# EAGLE design BattleBits_V2_routed (EAGLE 9.3.2)
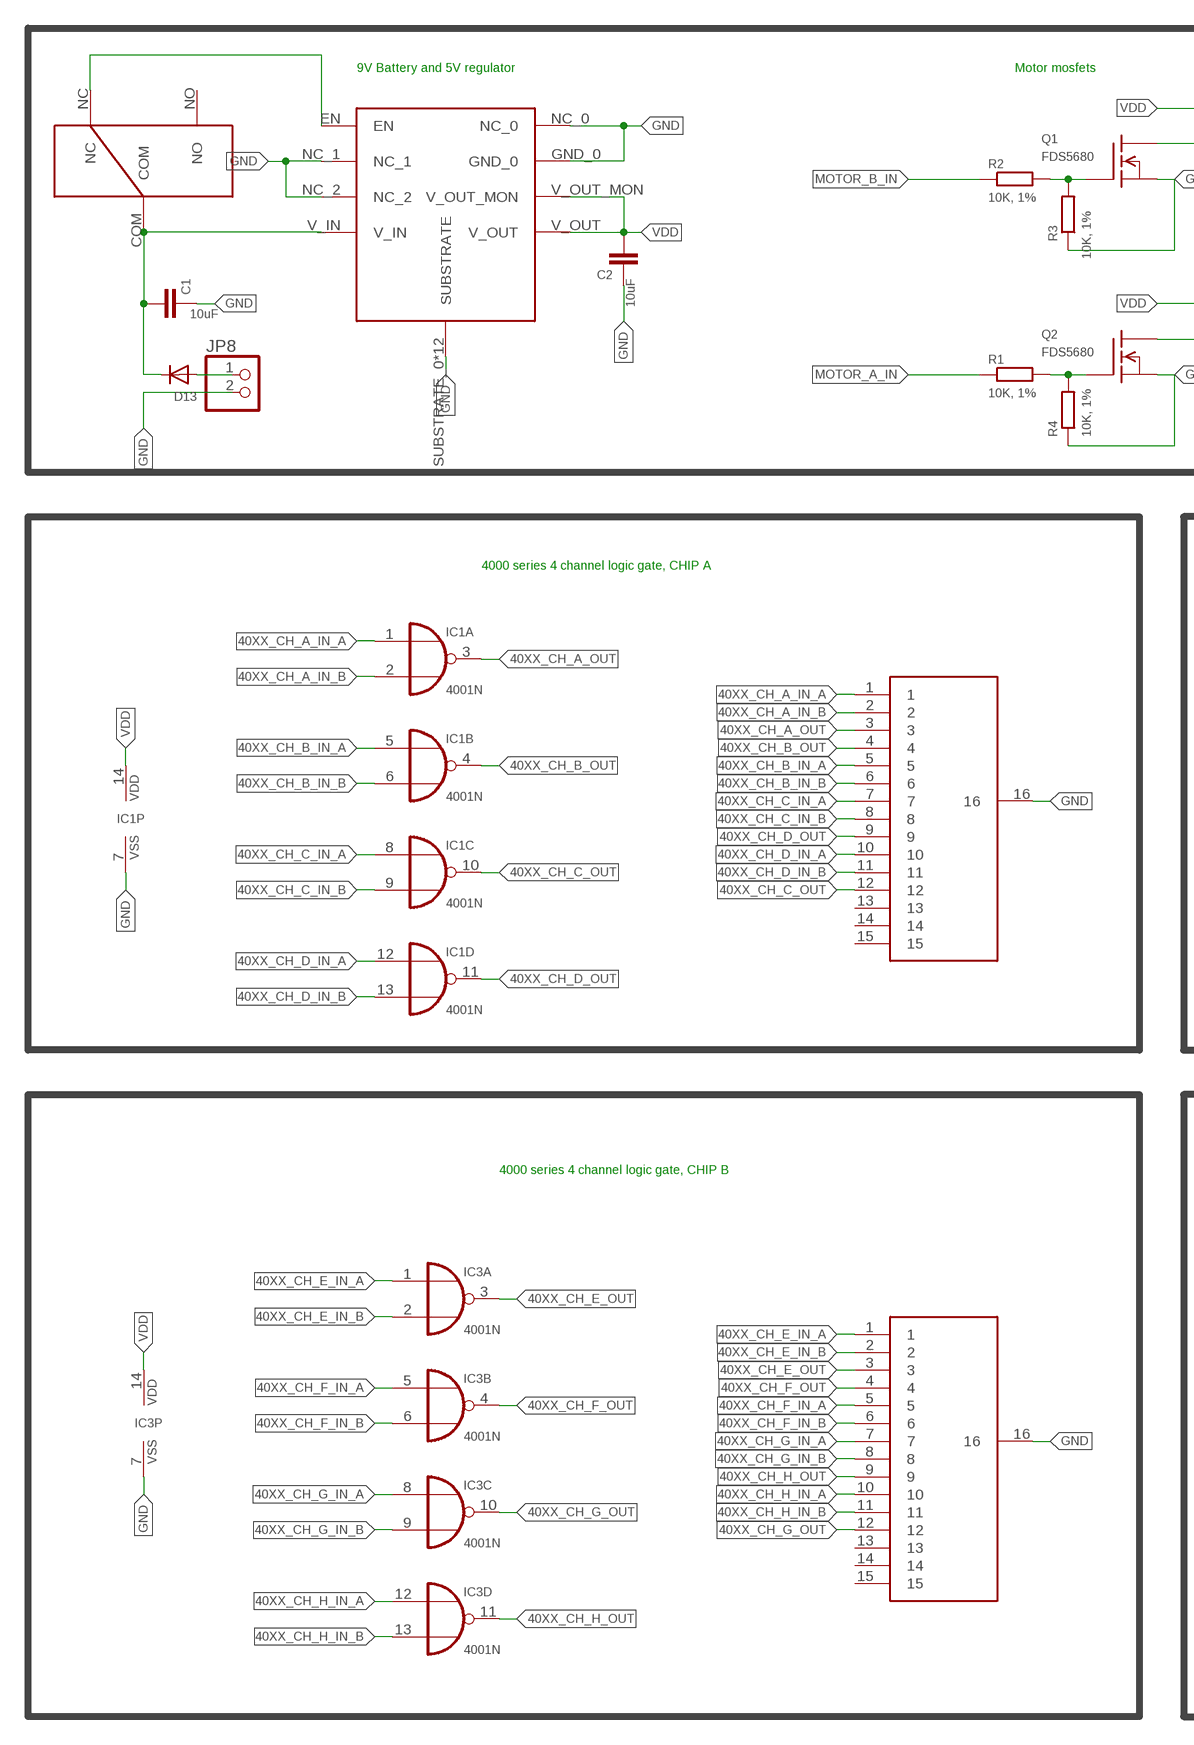
[diagram p0: schematic, sheet 1, part 1 of 2]
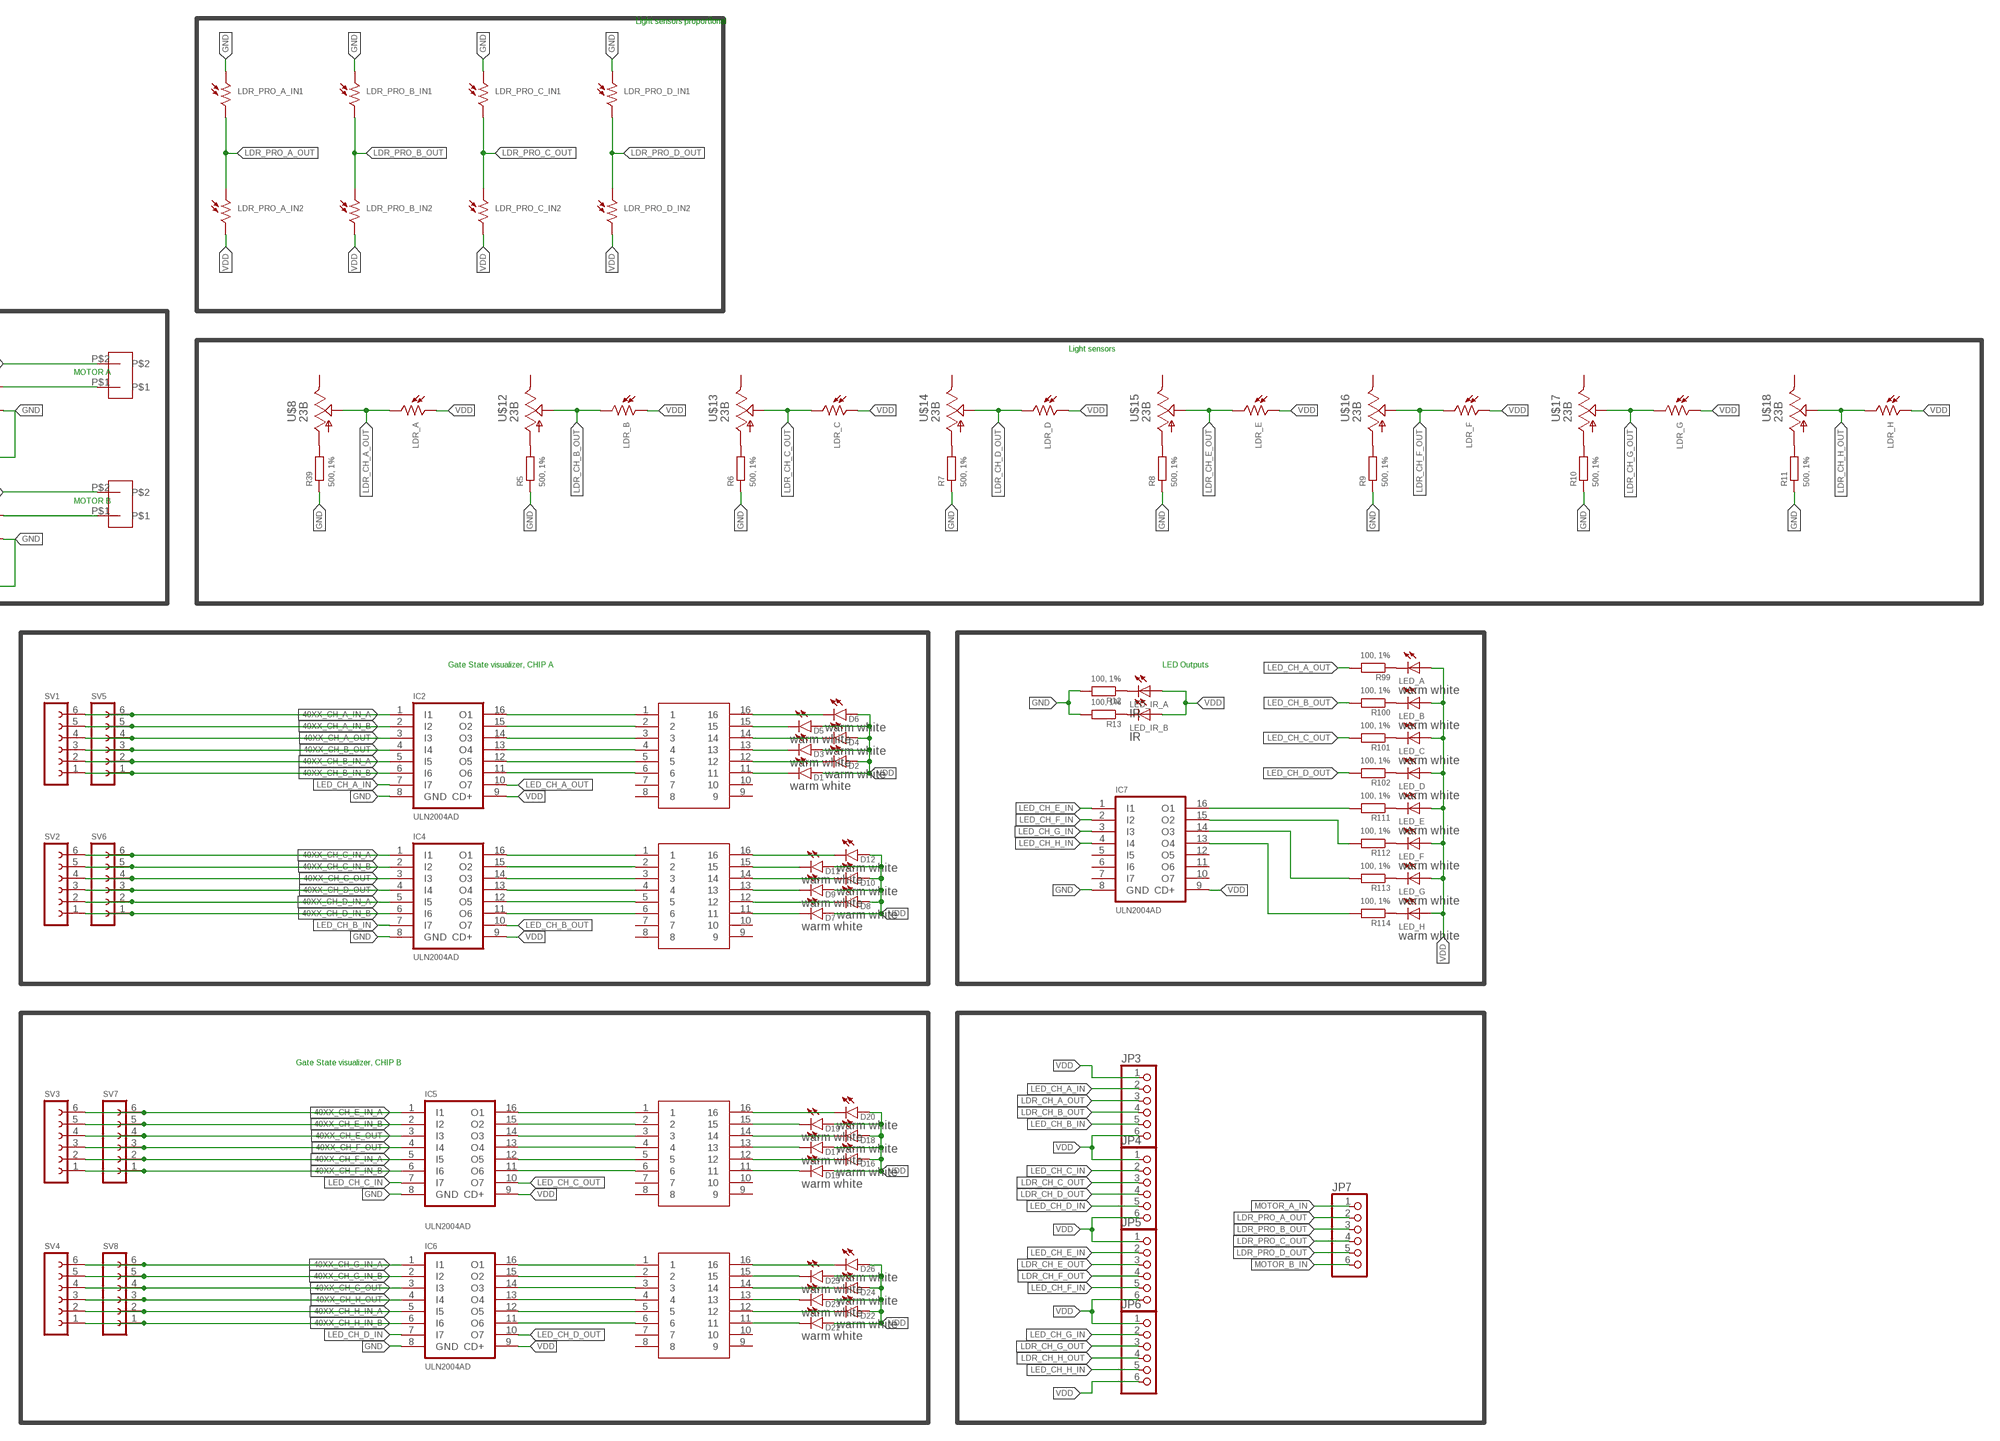
[diagram p1: schematic, sheet 1, part 2 of 2]

## Parts
C1  10uF  C-EUC3216  [C3216]
C2  10uF  C-EUC3216  [C3216]
D1  warm white  LED1206  [LED-1206]
D2  warm white  LED1206  [LED-1206]
D3  warm white  LED1206  [LED-1206]
D4  warm white  LED1206  [LED-1206]
D5  warm white  LED1206  [LED-1206]
D6  warm white  LED1206  [LED-1206]
D7  warm white  LED1206  [LED-1206]
D8  warm white  LED1206  [LED-1206]
D9  warm white  LED1206  [LED-1206]
D10  warm white  LED1206  [LED-1206]
D11  warm white  LED1206  [LED-1206]
D12  warm white  LED1206  [LED-1206]
D13  DIODESMA  [SMADIODE]
D15  warm white  LED1206  [LED-1206]
D16  warm white  LED1206  [LED-1206]
D17  warm white  LED1206  [LED-1206]
D18  warm white  LED1206  [LED-1206]
D19  warm white  LED1206  [LED-1206]
D20  warm white  LED1206  [LED-1206]
D21  warm white  LED1206  [LED-1206]
D22  warm white  LED1206  [LED-1206]
D23  warm white  LED1206  [LED-1206]
D24  warm white  LED1206  [LED-1206]
D25  warm white  LED1206  [LED-1206]
D26  warm white  LED1206  [LED-1206]
IC1  4001N  [DIL14]
IC2  ULN2004AD  [SO16]
IC3  4001N  [DIL14]
IC4  ULN2004AD  [SO16]
IC5  ULN2004AD  [SO16]
IC6  ULN2004AD  [SO16]
IC7  ULN2004AD  [SO16]
JP3  PINHD-1X6  [1X06]
JP4  PINHD-1X6  [1X06]
JP5  PINHD-1X6  [1X06]
JP6  PINHD-1X6  [1X06]
JP7  PINHD-1X6  [1X06]
JP8  PINHD-1X2  [1X02]
LDR_A  V1060_21  [TO-5_V10]
LDR_B  V1060_21  [TO-5_V10]
LDR_C  V1060_21  [TO-5_V10]
LDR_D  V1060_21  [TO-5_V10]
LDR_E  V1060_21  [TO-5_V10]
LDR_F  V1060_21  [TO-5_V10]
LDR_G  V1060_21  [TO-5_V10]
LDR_H  V1060_21  [TO-5_V10]
LDR_PRO_A_IN1  V1060_21  [TO-5_V10]
LDR_PRO_A_IN2  V1060_21  [TO-5_V10]
LDR_PRO_B_IN1  V1060_21  [TO-5_V10]
LDR_PRO_B_IN2  V1060_21  [TO-5_V10]
LDR_PRO_C_IN1  V1060_21  [TO-5_V10]
LDR_PRO_C_IN2  V1060_21  [TO-5_V10]
LDR_PRO_D_IN1  V1060_21  [TO-5_V10]
LDR_PRO_D_IN2  V1060_21  [TO-5_V10]
LED_A  warm white  LED5MM  [LED5MM]
LED_B  warm white  LED5MM  [LED5MM]
LED_C  warm white  LED5MM  [LED5MM]
LED_D  warm white  LED5MM  [LED5MM]
LED_E  warm white  LED5MM  [LED5MM]
LED_F  warm white  LED5MM  [LED5MM]
LED_G  warm white  LED5MM  [LED5MM]
LED_H  warm white  LED5MM  [LED5MM]
LED_IR_A  IR  LED5MM  [LED5MM]
LED_IR_B  IR  LED5MM  [LED5MM]
Q1  FDS5680  [SO-8]
Q2  FDS5680  [SO-8]
R1  10K, 1%  R-EU_R3216  [R3216]
R2  10K, 1%  R-EU_R3216  [R3216]
R3  10K, 1%  R-EU_R3216  [R3216]
R4  10K, 1%  R-EU_R3216  [R3216]
R5  500, 1%  R-EU_R3216  [R3216]
R6  500, 1%  R-EU_R3216  [R3216]
R7  500, 1%  R-EU_R3216  [R3216]
R8  500, 1%  R-EU_R3216  [R3216]
R9  500, 1%  R-EU_R3216  [R3216]
R10  500, 1%  R-EU_R3216  [R3216]
R11  500, 1%  R-EU_R3216  [R3216]
R12  100, 1%  R-EU_R3216  [R3216]
R13  100, 1%  R-EU_R3216  [R3216]
R39  500, 1%  R-EU_R3216  [R3216]
R99  100, 1%  R-EU_R3216  [R3216]
R100  100, 1%  R-EU_R3216  [R3216]
R101  100, 1%  R-EU_R3216  [R3216]
R102  100, 1%  R-EU_R3216  [R3216]
R111  100, 1%  R-EU_R3216  [R3216]
R112  100, 1%  R-EU_R3216  [R3216]
R113  100, 1%  R-EU_R3216  [R3216]
R114  100, 1%  R-EU_R3216  [R3216]
SV1  FE06-1  [FE06]
SV2  FE06-1  [FE06]
SV3  FE06-1  [FE06]
SV4  FE06-1  [FE06]
SV5  FE06-1  [FE06]
SV6  FE06-1  [FE06]
SV7  FE06-1  [FE06]
SV8  FE06-1  [FE06]
U$1  MOTOR  [GEARMOTOR]
U$2  MOTOR  [GEARMOTOR]
U$3  15_RES_BUS_SOIC16  [SO16]
U$4  ROHM_LDO  [HTSOP-J8]
U$5  8_RES_ISO_SOIC-16  [SO16]
U$6  8_RES_ISO_SOIC-16  [SO16]
U$7  SLIDE_SWITCH  [SLIDE_SWITCH]
U$8  23B  [23B-GULL_WING]
U$9  8_RES_ISO_SOIC-16  [SO16]
U$10  8_RES_ISO_SOIC-16  [SO16]
U$11  15_RES_BUS_SOIC16  [SO16]
U$12  23B  [23B-GULL_WING]
U$13  23B  [23B-GULL_WING]
U$14  23B  [23B-GULL_WING]
U$15  23B  [23B-GULL_WING]
U$16  23B  [23B-GULL_WING]
U$17  23B  [23B-GULL_WING]
U$18  23B  [23B-GULL_WING]

## Nets
40XX_CH_A_IN_A [SIGNAL]: IC1.1(A:I0) IC2.1(I1) SV1.6 SV5.6 U$11.1
40XX_CH_A_IN_B [SIGNAL]: IC1.2(A:I1) IC2.2(I2) SV1.5 SV5.5 U$11.2
40XX_CH_A_OUT [SIGNAL]: IC1.3(A:O) IC2.3(I3) SV1.4 SV5.4 U$11.3
40XX_CH_B_IN_A [SIGNAL]: IC1.5(B:I0) IC2.5(I5) SV1.2 SV5.2 U$11.5
40XX_CH_B_IN_B [SIGNAL]: IC1.6(B:I1) IC2.6(I6) SV1.1 SV5.1 U$11.6
40XX_CH_B_OUT [SIGNAL]: IC1.4(B:O) IC2.4(I4) SV1.3 SV5.3 U$11.4
40XX_CH_C_IN_A [SIGNAL]: IC1.8(C:I0) IC4.1(I1) SV2.6 SV6.6 U$11.7
40XX_CH_C_IN_B [SIGNAL]: IC1.9(C:I1) IC4.2(I2) SV2.5 SV6.5 U$11.8
40XX_CH_C_OUT [SIGNAL]: IC1.10(C:O) IC4.3(I3) SV2.4 SV6.4 U$11.12
40XX_CH_D_IN_A [SIGNAL]: IC1.12(D:I0) IC4.5(I5) SV2.2 SV6.2 U$11.10
40XX_CH_D_IN_B [SIGNAL]: IC1.13(D:I1) IC4.6(I6) SV2.1 SV6.1 U$11.11
40XX_CH_D_OUT [SIGNAL]: IC1.11(D:O) IC4.4(I4) SV2.3 SV6.3 U$11.9
40XX_CH_E_IN_A [SIGNAL]: IC3.1(A:I0) IC5.1(I1) SV3.6 SV7.6 U$3.1
40XX_CH_E_IN_B [SIGNAL]: IC3.2(A:I1) IC5.2(I2) SV3.5 SV7.5 U$3.2
40XX_CH_E_OUT [SIGNAL]: IC3.3(A:O) IC5.3(I3) SV3.4 SV7.4 U$3.3
40XX_CH_F_IN_A [SIGNAL]: IC3.5(B:I0) IC5.5(I5) SV3.2 SV7.2 U$3.5
40XX_CH_F_IN_B [SIGNAL]: IC3.6(B:I1) IC5.6(I6) SV3.1 SV7.1 U$3.6
40XX_CH_F_OUT [SIGNAL]: IC3.4(B:O) IC5.4(I4) SV3.3 SV7.3 U$3.4
40XX_CH_G_IN_A [SIGNAL]: IC3.8(C:I0) IC6.1(I1) SV4.6 SV8.6 U$3.7
40XX_CH_G_IN_B [SIGNAL]: IC3.9(C:I1) IC6.2(I2) SV4.5 SV8.5 U$3.8
40XX_CH_G_OUT [SIGNAL]: IC3.10(C:O) IC6.3(I3) SV4.4 SV8.4 U$3.12
40XX_CH_H_IN_A [SIGNAL]: IC3.12(D:I0) IC6.5(I5) SV4.2 SV8.2 U$3.10
40XX_CH_H_IN_B [SIGNAL]: IC3.13(D:I1) IC6.6(I6) SV4.1 SV8.1 U$3.11
40XX_CH_H_OUT [SIGNAL]: IC3.11(D:O) IC6.4(I4) SV4.3 SV8.3 U$3.9
GND: C1.1 C2.1 IC1.7(P:VSS) IC2.8(GND) IC3.7(P:VSS) IC4.8(GND) IC5.8(GND) IC6.8(GND) IC7.8(GND) JP8.2 LDR_PRO_A_IN1.1 LDR_PRO_B_IN1.1 LDR_PRO_C_IN1.1 LDR_PRO_D_IN1.1 Q1.1(S) Q1.2(S) Q1.3(S) Q2.1(S) Q2.2(S) Q2.3(S) R3.1 R4.1 R5.1 R6.1 R7.1 R8.1 R9.1 R10.1 R11.1 R12.2 R13.2 R39.1 U$3.16 U$4.GND_0 U$4.NC_0 U$4.NC_1 U$4.NC_2 U$4.SUBSTRATE_0(SUBSTRATE) U$4.SUBSTRATE_1(SUBSTRATE) U$4.SUBSTRATE_2(SUBSTRATE) U$4.SUBSTRATE_3(SUBSTRATE) U$4.SUBSTRATE_4(SUBSTRATE) U$4.SUBSTRATE_5(SUBSTRATE) U$4.SUBSTRATE_6(SUBSTRATE) U$4.SUBSTRATE_7(SUBSTRATE) U$4.SUBSTRATE_8(SUBSTRATE) U$4.SUBSTRATE_9(SUBSTRATE) U$4.SUBSTRATE_10(SUBSTRATE) U$4.SUBSTRATE_11(SUBSTRATE) U$11.16
LDR_CH_A_OUT [SIGNAL]: JP3.3 LDR_A.2 U$8.2
LDR_CH_B_OUT: JP3.4 LDR_B.2 U$12.2
LDR_CH_C_OUT [SIGNAL]: JP4.3 LDR_C.2 U$13.2
LDR_CH_D_OUT: JP4.4 LDR_D.2 U$14.2
LDR_CH_E_OUT [SIGNAL]: JP5.3 LDR_E.2 U$15.2
LDR_CH_F_OUT: JP5.4 LDR_F.2 U$16.2
LDR_CH_G_OUT [SIGNAL]: JP6.3 LDR_G.2 U$17.2
LDR_CH_H_OUT: JP6.4 LDR_H.2 U$18.2
LDR_PRO_A_OUT: JP7.2 LDR_PRO_A_IN1.2 LDR_PRO_A_IN2.1
LDR_PRO_B_OUT: JP7.3 LDR_PRO_B_IN1.2 LDR_PRO_B_IN2.1
LDR_PRO_C_OUT: JP7.4 LDR_PRO_C_IN1.2 LDR_PRO_C_IN2.1
LDR_PRO_D_OUT: JP7.5 LDR_PRO_D_IN1.2 LDR_PRO_D_IN2.1
LED_CH_A_IN [SIGNAL]: IC2.7(I7) JP3.2
LED_CH_A_OUT: IC2.10(O7) R99.2
LED_CH_B_IN [SIGNAL]: IC4.7(I7) JP3.5
LED_CH_B_OUT: IC4.10(O7) R100.2
LED_CH_C_IN [SIGNAL]: IC5.7(I7) JP4.2
LED_CH_C_OUT: IC5.10(O7) R101.2
LED_CH_D_IN [SIGNAL]: IC6.7(I7) JP4.5
LED_CH_D_OUT: IC6.10(O7) R102.2
LED_CH_E_IN [SIGNAL]: IC7.1(I1) JP5.2
LED_CH_F_IN [SIGNAL]: IC7.2(I2) JP5.5
LED_CH_G_IN [SIGNAL]: IC7.3(I3) JP6.2
LED_CH_H_IN [SIGNAL]: IC7.4(I4) JP6.5
MOTOR_A-: Q1.5(D) Q1.6(D) Q1.7(D) Q1.8(D) U$1.P$1
MOTOR_A_IN [SIGNAL]: JP7.1 R1.1
MOTOR_B-: Q2.5(D) Q2.6(D) Q2.7(D) Q2.8(D) U$2.P$1
MOTOR_B_IN [SIGNAL]: JP7.6 R2.1
N$5: IC2.16(O1) U$5.1
N$6 [SIGNAL]: Q1.4(G) R2.2 R3.2
N$7 [SIGNAL]: Q2.4(G) R1.2 R4.2
N$8: IC2.15(O2) U$5.2
N$9: IC2.14(O3) U$5.3
N$10: IC2.13(O4) U$5.4
N$11: IC2.12(O5) U$5.5
N$12: IC2.11(O6) U$5.6
N$13: IC6.16(O1) U$10.1
N$14: IC4.16(O1) U$6.1
N$15: IC4.15(O2) U$6.2
N$16: IC4.14(O3) U$6.3
N$17: IC4.13(O4) U$6.4
N$18: IC4.12(O5) U$6.5
N$19: IC4.11(O6) U$6.6
N$20: D6.C U$5.16
N$21: IC6.14(O3) U$10.3
N$22: D5.C U$5.15
N$23: IC5.16(O1) U$9.1
N$24: D4.C U$5.14
N$25: IC5.15(O2) U$9.2
N$26: D3.C U$5.13
N$27: IC5.14(O3) U$9.3
N$28: D2.C U$5.12
N$29: IC5.13(O4) U$9.4
N$30: D1.C U$5.11
N$31: IC5.12(O5) U$9.5
N$32: IC5.11(O6) U$9.6
N$33: IC6.15(O2) U$10.2
N$34: IC6.13(O4) U$10.4
N$35: IC6.12(O5) U$10.5
N$36: D12.C U$6.16
N$37: D11.C U$6.15
N$38: IC6.11(O6) U$10.6
N$39: D10.C U$6.14
N$40: D9.C U$6.13
N$41: D8.C U$6.12
N$42: D7.C U$6.11
N$44 [SIGNAL]: R39.2 U$8.1
N$45 [SIGNAL]: R5.2 U$12.1
N$46: IC7.16(O1) R111.2
N$47: IC7.15(O2) R112.2
N$48: IC7.14(O3) R113.2
N$49: IC7.13(O4) R114.2
N$50 [SIGNAL]: R6.2 U$13.1
N$51 [SIGNAL]: R7.2 U$14.1
N$52 [SIGNAL]: R8.2 U$15.1
N$53 [SIGNAL]: R9.2 U$16.1
N$54 [SIGNAL]: R10.2 U$17.1
N$55 [SIGNAL]: R11.2 U$18.1
N$61: D13.A JP8.1
N$62: U$4.EN U$7.NC
N$63: LED_IR_A.K(C) R12.1
N$64: LED_IR_B.K(C) R13.1
N$86: D20.C U$9.16
N$87: D19.C U$9.15
N$88: D18.C U$9.14
N$89: D17.C U$9.13
N$90: D16.C U$9.12
N$91: D15.C U$9.11
N$92: D26.C U$10.16
N$93: D25.C U$10.15
N$94: D24.C U$10.14
N$95: D23.C U$10.13
N$96: D22.C U$10.12
N$97: D21.C U$10.11
N$111: LED_A.K(C) R99.1
N$112: LED_B.K(C) R100.1
N$113: LED_C.K(C) R101.1
N$114: LED_D.K(C) R102.1
N$123: LED_E.K(C) R111.1
N$124: LED_F.K(C) R112.1
N$125: LED_G.K(C) R113.1
N$126: LED_H.K(C) R114.1
VBAT: C1.2 D13.C U$4.V_IN U$7.COM
VDD: C2.2 D1.A D2.A D3.A D4.A D5.A D6.A D7.A D8.A D9.A D10.A D11.A D12.A D15.A D16.A D17.A D18.A D19.A D20.A D21.A D22.A D23.A D24.A D25.A D26.A IC1.14(P:VDD) IC2.9(CD+) IC3.14(P:VDD) IC4.9(CD+) IC5.9(CD+) IC6.9(CD+) IC7.9(CD+) JP3.1 JP3.6 JP4.1 JP4.6 JP5.1 JP5.6 JP6.1 JP6.6 LDR_A.1 LDR_B.1 LDR_C.1 LDR_D.1 LDR_E.1 LDR_F.1 LDR_G.1 LDR_H.1 LDR_PRO_A_IN2.2 LDR_PRO_B_IN2.2 LDR_PRO_C_IN2.2 LDR_PRO_D_IN2.2 LED_A.A LED_B.A LED_C.A LED_D.A LED_E.A LED_F.A LED_G.A LED_H.A LED_IR_A.A LED_IR_B.A U$1.P$2 U$2.P$2 U$4.V_OUT U$4.V_OUT_MON
Unconnected: IC7.5(I5) IC7.6(I6) IC7.7(I7) IC7.10(O7) IC7.11(O6) IC7.12(O5) U$3.13 U$3.14 U$3.15 U$5.7 U$5.8 U$5.9 U$5.10 U$6.7 U$6.8 U$6.9 U$6.10 U$7.NO U$8.3 U$9.7 U$9.8 U$9.9 U$9.10 U$10.7 U$10.8 U$10.9 U$10.10 U$11.13 U$11.14 U$11.15 U$12.3 U$13.3 U$14.3 U$15.3 U$16.3 U$17.3 U$18.3

## Notes on the sheet
- Light sensors proportional
- 9V Battery and 5V regulator | Motor mosfets
- Light sensors
- MOTOR A
- MOTOR B
- 4000 series 4 channel logic gate, CHIP A | Gate State visualizer, CHIP A | LED Outputs
- 4000 series 4 channel logic gate, CHIP B | Gate State visualizer, CHIP B

## Library data of the parts
C1 C2 = rcl:C-EU: CAPACITOR, European symbol; SPICEPREFIX: C
D1-D12 D15-D26 = SparkFun-LED:LED: LED (Generic) Standard schematic elements and footprints for 5mm, 3mm, 1206, and 0603 sized LEDs. Generic LEDs with no color specified.
D13 = adafruit:DIODE: Diode SMADIODE - SMA Surface Mount Package 20V 1A Schottky Diode Digikey: 641-1014-6-ND DO-1N4148 - Through Hole Small Current Diode SOD-123 20V 1 A (.5mV Vf) Schottky Diode - Digikey: MBRX120TPMSCT-ND SOD-323 10V 570mA (.38mV Vf, 3ns) Schottky Diode - Digikey: ZLLS410CT-ND SOD-523 30V 30mA Schottky Diode (RB751S-40TE61) - Digikey: RB751S-40TE61CT-ND SOT23-R/W - SOT23 Package (R = Solder Paste/Reflow Ovens, W = Hand-Soldering) BAT54Film 40V 300mA - Digikey: 497-7162-1-ND
IC1 IC3 = 40xx:4001: Quad 2-input NOR
IC2 IC4-IC7 = uln-udn:ULN2004A: DRIVER ARRAY
JP3-JP7 = adafruit:PINHD-1X6: PIN HEADER
JP8 = pinhead:PINHD-1X2: PIN HEADER
LDR_A LDR_B LDR_C LDR_D LDR_E LDR_F LDR_G LDR_H LDR_PRO_A_IN1 LDR_PRO_A_IN2 LDR_PRO_B_IN1 LDR_PRO_B_IN2 LDR_PRO_C_IN1 LDR_PRO_C_IN2 LDR_PRO_D_IN1 LDR_PRO_D_IN2 = photo-elements:?1060*: Sensor Street Light control Source: http://optoelectronics.perkinelmer.com/content/Datasheets/DTS_PhotocellsB1060.pdf
LED_A LED_B LED_C LED_D LED_E LED_F LED_G LED_H LED_IR_A LED_IR_B = adafruit:LED: LED OSRAM: - CHIPLED LG R971, LG N971, LY N971, LG Q971, LY Q971, LO R971, LY R971 LH N974, LH R974 LS Q976, LO Q976, LY Q976 LO Q996 - Hyper CHIPLED LW Q18S LB Q993, LB Q99A, LB R99A - SideLED LS A670, LO A670, LY A670, LG A670, LP A670 LB A673, LV A673, LT A673, LW A673 LH A674 LY A675 LS A676, LA A676, LO A676, LY A676, LW A676 LS A679, LY A679, LG A679 - Hyper Micro SIDELED® LS Y876, LA Y876, LO Y876, LY Y876 LT Y87S - SmartLED LW L88C, LW L88S LB L89C, LB L89S, LG L890 LS L89K, LO L89K, LY L89K LS L896, LA L896, LO L896, LY L896 - TOPLED LS T670, LO T670, LY T670, LG T670, LP T670 LSG T670, LSP T670, LSY T670, LOP T670, LYG T670 LG T671, LOG T671, LSG T671 LB T673, LV T673, LT T673, LW T673 LH T674 LS T676, LA T676, LO T676, LY T676, LB T676, LH T676, LSB T676, LW T676 LB T67C, LV T67C, LT T67C, LS T67K, LO T67K, LY T67K, LW E67C LS E67B, LA E67B, LO E67B, LY E67B, LB E67C, LV E67C, LT E67C LW T67C LS T679, LY T679, LG T679 LS T770, LO T770, LY T770, LG T770, LP T770 LB T773, LV T773, LT T773, LW T773 LH T774 LS E675, LA E675, LY E675, LS T675 LS T776, LA T776, LO T776, LY T776, LB T776 LHGB T686 LT T68C, LB T68C - Hyper Mini TOPLED® LB M676 - Mini TOPLED Santana® LG M470 LS M47K, LO M47K, LY M47K Source: http://www.osram.convergy.de/
Q1 Q2 = transistor-fet:FDS5680: 60V N-Channel PowerTrench TM MOSFET FAIRCHILD FDS5680.pdf
R1-R13 R39 R99-R102 R111-R114 = rcl:R-EU_: RESISTOR, European symbol; SPICEPREFIX: R
SV1-SV8 = con-lsta:FE06-1: FEMALE HEADER; OC_FARNELL: unknown; OC_NEWARK: unknown
U$1 U$2 = gearmotor:MOTOR
U$3 U$11 = resistorArrayBus:15_RES_BUS_SOIC16
U$4 = Rohm-ldo:ROHM_LDO
U$5 U$6 U$9 U$10 = resistorArrayBus:8_RES_ISO_SOIC-16
U$7 = SlideSwitch:SLIDE_SWITCH
U$8 U$12-U$18 = bourns_trimpot:23B

## Net classes
0 PWR: width 0.305 mm, drill 0.3 mm, clearance 0.152 mm
1 SIGNAL: width 0.305 mm, drill 0.3 mm, clearance 0.152 mm

## Board
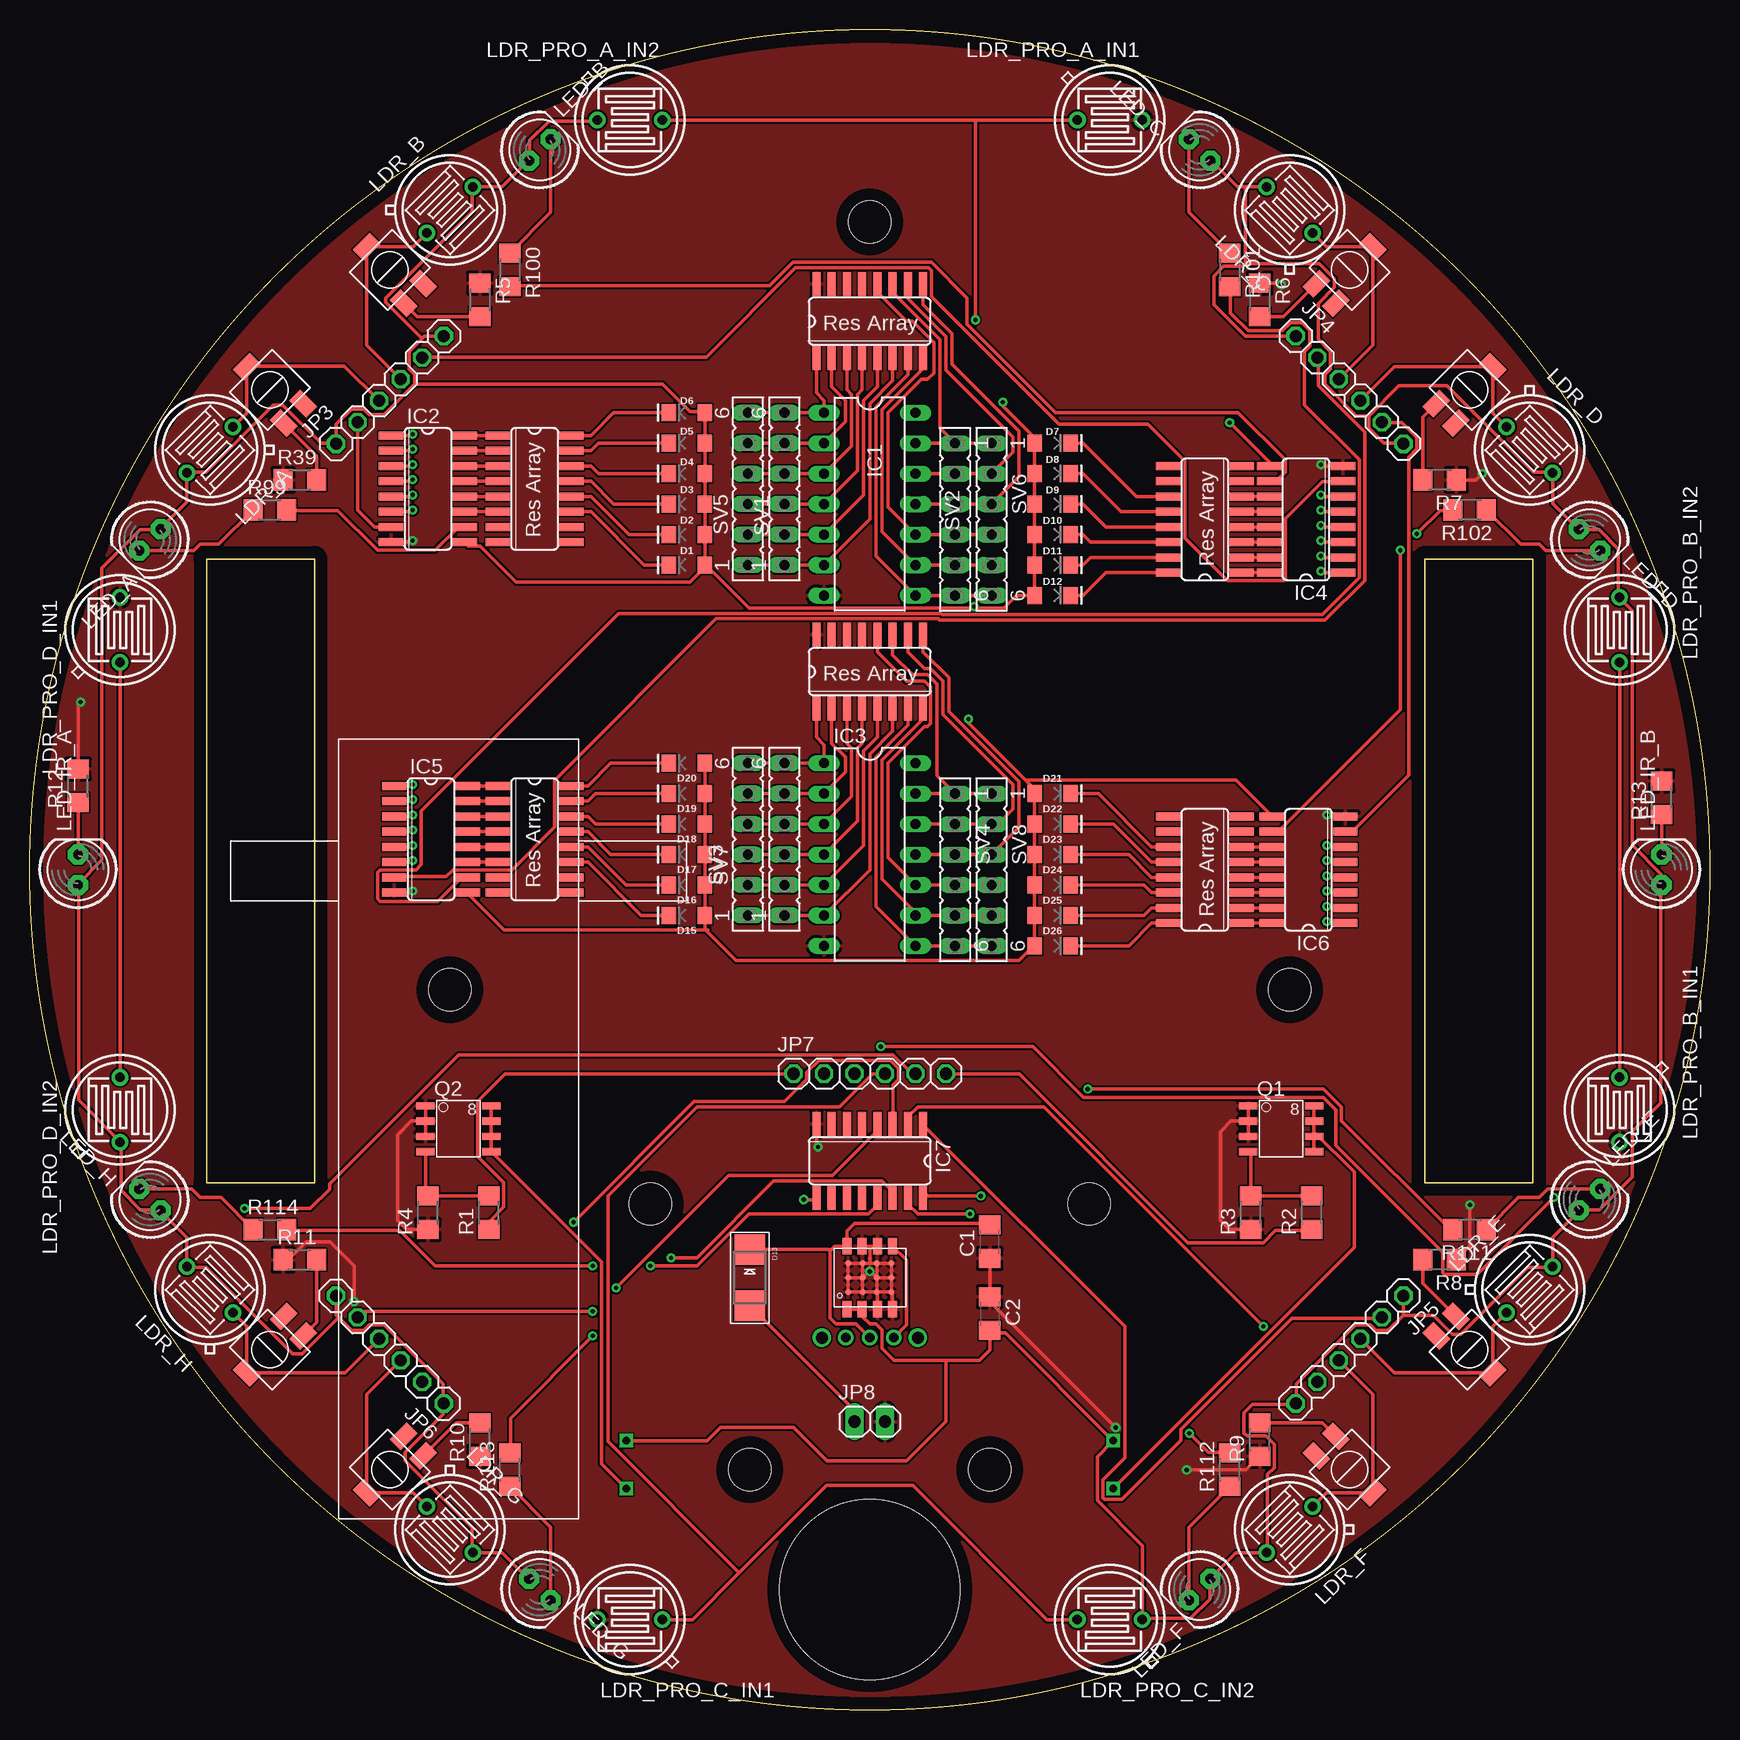
[diagram p2: board, top side]
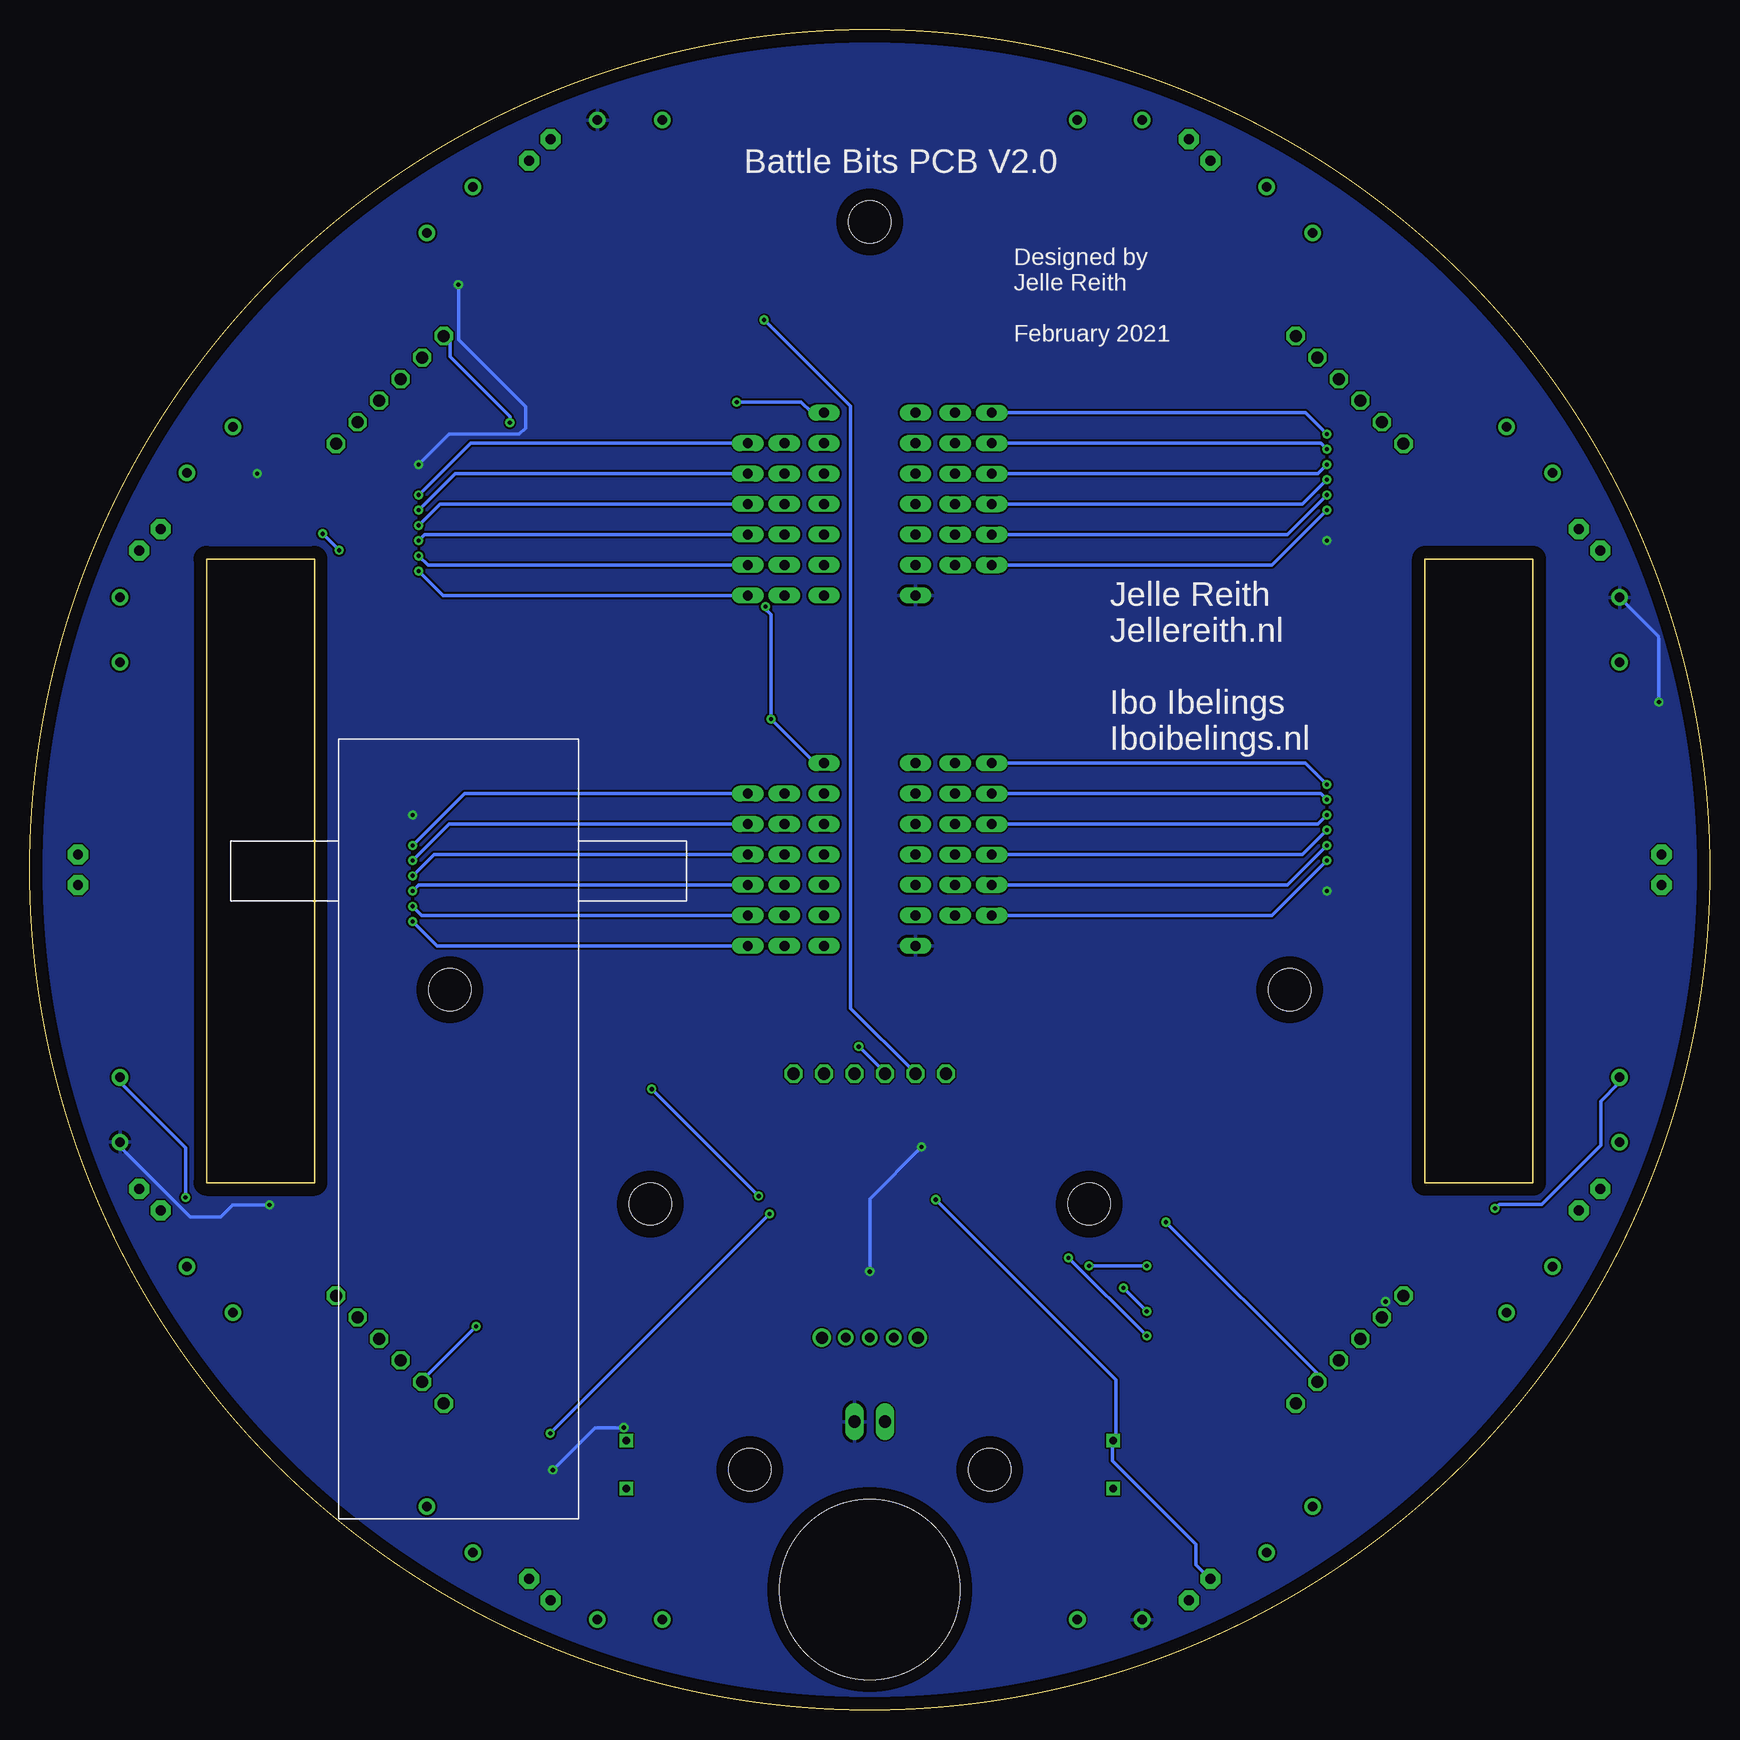
[diagram p3: board, bottom side, seen from below]

Size 140 x 140 mm. Coordinates in mm from the lower left corner, seen from the top.
Outline: circle at 70,70 radius 70
Copper layers (1*16): Top 0.035mm / dielectric 1.5mm / Bottom 0.035mm
Design rules "default *": minimum track width 6mil, minimum drill 0.35mm, track to track 6mil, track to pad 6mil, pad to pad 6mil, via to via 6mil, smd to smd 6mil, copper to edge 40mil, drill to drill 6mil, minimum pad ring 10mil, minimum via ring 8mil, stop-mask expansion 4mil, vias tented up to drill 0mil, thermal gap 10mil
Holes 15 mm at 70,10
Holes 3.5 mm at 60,20 80,20 70,124 105,60 35,60

### Footprints (pad centres in the part's own frame; a part is rotated, then mirrored left to right if it is on the bottom)
C3216 = smd 1.6 x 1.8: 1 -1.4,0; 2 1.4,0
LED-1206 = smd 1.2 x 1.4: A -1.5,0; C 1.5,0
SMADIODE = smd 2.54 x 2.54: A 2.349,0; C -2.349,0
DIL14 = drill 0.813 long: 1 -7.62,-3.81; 2 -5.08,-3.81; 3 -2.54,-3.81; 4 0,-3.81; 5 2.54,-3.81; 6 5.08,-3.81; 7 7.62,-3.81; 8 7.62,3.81; 9 5.08,3.81; 10 2.54,3.81; 11 0,3.81; 12 -2.54,3.81; 13 -5.08,3.81; 14 -7.62,3.81
SO16 = smd 0.66 x 2.032: 1 -4.445,-3.073; 2 -3.175,-3.073; 3 -1.905,-3.073; 4 -0.635,-3.073; 5 0.635,-3.073; 6 1.905,-3.073; 7 3.175,-3.073; 8 4.445,-3.073; 9 4.445,3.073; 10 3.175,3.073; 11 1.905,3.073; 12 0.635,3.073; 13 -0.635,3.073; 14 -1.905,3.073; 15 -3.175,3.073; 16 -4.445,3.073
1X06 = drill 1.016 octagon: 1 -6.35,0; 2 -3.81,0; 3 -1.27,0; 4 1.27,0; 5 3.81,0; 6 6.35,0
1X02 = drill 1.016 long: 1 -1.27,0; 2 1.27,0
TO-5_V10 = drill 0.8 pad 1.4: 1 -2.7,0; 2 2.7,0
LED5MM = drill 0.813 pad 1.676 octagon: A -1.27,0; K 1.27,0
SO-8 = smd 1.524 x 0.61: 1 -2.743,1.905; 2 -2.743,0.635; 3 -2.743,-0.635; 4 -2.743,-1.905; 5 2.743,-1.905; 6 2.743,-0.635; 7 2.743,0.635; 8 2.743,1.905
R3216 = smd 1.6 x 1.8: 1 -1.4,0; 2 1.4,0
FE06 = drill 0.813 long: 1 -6.35,0; 2 -3.81,0; 3 -1.27,0; 4 1.27,0; 5 3.81,0; 6 6.35,0
GEARMOTOR = drill 0.6 square: P$1 14,-30; P$2 14,-26 | hole 3.5: 16,-6.27
SO16' = smd 2.032 x 0.66: 1 -3.073,4.445; 2 -3.073,3.175; 3 -3.073,1.905; 4 -3.073,0.635; 5 -3.073,-0.635; 6 -3.073,-1.905; 7 -3.073,-3.175; 8 -3.073,-4.445; 9 3.073,-4.445; 10 3.073,-3.175; 11 3.073,-1.905; 12 3.073,-0.635; 13 3.073,0.635; 14 3.073,1.905; 15 3.073,3.175; 16 3.073,4.445
HTSOP-J8 = smd 1.35 x 0.75: EN 2.625,-1.905; GND_0 -2.625,-0.635; NC_0 -2.625,-1.905; NC_1 2.625,-0.635; NC_2 2.625,0.635; V_IN 2.625,1.905; V_OUT -2.625,1.905; V_OUT_MON -2.625,0.635 | smd 0.5 x 0.5: SUBSTRATE_0 -1.2,1.8; SUBSTRATE_1 -1.2,0.6; SUBSTRATE_2 -1.2,-0.6; SUBSTRATE_3 -1.2,-1.8; SUBSTRATE_4 0,1.8; SUBSTRATE_5 0,0.6; SUBSTRATE_6 0,-0.6; SUBSTRATE_7 0,-1.8; SUBSTRATE_8 1.2,1.8; SUBSTRATE_9 1.2,0.6; SUBSTRATE_10 1.2,-0.6; SUBSTRATE_11 1.2,-1.8
SLIDE_SWITCH = drill 0.8: COM 0,0; NC -2,0; NO 2,0 | drill 1: N.C.0 -4,0; N.C.1 4,0
23B-GULL_WING = smd 2 x 1.3: 1 2.75,-1.15; 3 2.75,1.15 | smd 1.3 x 2: 2 -2.75,0

### Placement (x,y rotation side)
C1  80,39 90 top
C2  80,33 270 top
D1  54.76,95.4 180 top
D2  54.76,97.94 180 top
D3  54.76,100.48 180 top
D4  54.76,103.02 180 top
D5  54.76,105.56 180 top
D6  54.76,108.1 180 top
D7  85.24,105.56 0 top
D8  85.24,103.02 0 top
D9  85.24,100.48 0 top
D10  85.24,97.94 0 top
D11  85.24,95.4 0 top
D12  85.24,92.86 0 top
D13  60,36 270 top
D15  54.76,66.19 180 top
D16  54.76,68.73 180 top
D17  54.76,71.27 180 top
D18  54.76,73.81 180 top
D19  54.76,76.35 180 top
D20  54.76,78.89 180 top
D21  85.24,76.35 0 top
D22  85.24,73.81 0 top
D23  85.24,71.27 0 top
D24  85.24,68.73 0 top
D25  85.24,66.19 0 top
D26  85.24,63.65 0 top
IC1  70,100.48 270 top
IC2  33.17,101.75 270 top
IC3  70,71.27 270 top
IC4  106.37,99.21 90 top
IC5  33.42,72.54 270 top
IC6  106.58,70 90 top
IC7  70,45.73 180 top
JP3  30,110 45 top
JP4  110,110 315 top
JP5  110,30 225 top
JP6  30,30 135 top
JP7  70,53 0 top
JP8  70,24 0 top
LDR_A  15,105 45 top
LDR_B  35,125 225 top
LDR_C  105,125 315 top
LDR_D  125,105 135 top
LDR_E  125,35 225 top
LDR_F  105,15 45 top
LDR_G  35,15 135 top
LDR_H  15,35 315 top
LDR_PRO_A_IN1  90,132.5 180 top
LDR_PRO_A_IN2  50,132.5 180 top
LDR_PRO_B_IN1  132.5,50 90 top
LDR_PRO_B_IN2  132.5,90 90 top
LDR_PRO_C_IN1  50,7.5 0 top
LDR_PRO_C_IN2  90,7.5 0 top
LDR_PRO_D_IN1  7.5,90 270 top
LDR_PRO_D_IN2  7.5,50 270 top
LED_A  10,97.5 225 top
LED_B  42.5,130 45 top
LED_C  97.5,130 135 top
LED_D  130,97.5 315 top
LED_E  130,42.5 45 top
LED_F  97.5,10 225 top
LED_G  42.5,10 315 top
LED_H  10,42.5 135 top
LED_IR_A  4,70 90 top
LED_IR_B  136,70 90 top
Q1  104.29,48.41 0 top
Q2  35.71,48.41 0 top
R1  38.25,41.42 90 top
R2  106.83,41.42 90 top
R3  101.75,41.42 90 top
R4  33.17,41.42 90 top
R5  37.5,117.5 270 top
R6  102.5,117.5 270 top
R7  117.5,102.5 180 top
R8  117.5,37.5 180 top
R9  102.5,22.5 90 top
R10  37.5,22.5 90 top
R11  22.5,37.5 0 top
R12  4,77 90 top
R13  136,76 90 top
R39  22.5,102.5 0 top
R99  20,100 0 top
R100  40,120 270 top
R101  100,120 270 top
R102  120,100 180 top
R111  120,40 180 top
R112  100,20 90 top
R113  40,20 90 top
R114  20,40 0 top
SV1  62.89,101.75 90 top
SV2  77.11,99.21 270 top
SV3  62.89,72.54 90 top
SV4  77.11,70 270 top
SV5  59.84,101.75 90 top
SV6  80.16,99.21 270 top
SV7  59.84,72.54 90 top
SV8  80.16,70 270 top
U$1  104.29,48.41 0 bottom
U$2  35.71,48.41 0 top
U$3  15_RES_BUS_SOIC16  [SO16']  70,86.51 90 top
U$4  70,36 90 top
U$5  8_RES_ISO_SOIC-16  [SO16']  42.06,101.75 0 top
U$6  8_RES_ISO_SOIC-16  [SO16']  97.94,99.21 180 top
U$7  70,31 180 top
U$8  20,110 315 top
U$9  8_RES_ISO_SOIC-16  [SO16']  42.06,72.54 0 top
U$10  8_RES_ISO_SOIC-16  [SO16']  97.94,70 180 top
U$11  15_RES_BUS_SOIC16  [SO16']  70,115.72 90 top
U$12  30,120 315 top
U$13  110,120 225 top
U$14  120,110 225 top
U$15  120,30 135 top
U$16  110,20 135 top
U$17  30,20 45 top
U$18  20,30 45 top

### Tracks (layer width: path | path; a pad name or v marks a point on that pad's centre or on a via)
40XX_CH_A_IN_A  (via drill 0.35)
  Top 0.305: U$11.1 65.56,109.75 66.19,109.12 IC1.1 SV1.6 SV5.6 | IC2.1 31.77,106.19 v31.9,106.32
  Bottom 0.305: v31.9,106.32 33.68,108.1 SV5.6
40XX_CH_A_IN_B  (via drill 0.35)
  Top 0.305: U$11.2 66.83,110.26 67.97,109.12 67.97,107.34 IC1.2 SV1.5 SV5.5 | IC2.2 31.77,104.92 v31.9,105.05
  Bottom 0.305: v31.9,105.05 32.41,105.56 SV5.5
40XX_CH_A_OUT  (via drill 0.35)
  Top 0.305: U$11.3 68.09,110 68.48,109.62 68.48,105.31 IC1.3 SV1.4 SV5.4 | IC2.3 31.77,103.66 v31.9,103.78
  Bottom 0.305: v31.9,103.78 32.66,103.02 SV5.4
40XX_CH_B_IN_A  (via drill 0.35)
  Top 0.305: U$11.5 70.64,110.26 69.49,109.12 69.49,101.24 IC1.5 SV1.2 SV5.2 | IC2.5 31.77,101.11 v31.9,101.24
  Bottom 0.305: v31.9,101.24 35.2,97.94 SV5.2
40XX_CH_B_IN_B  (via drill 0.35)
  Top 0.305: U$11.6 71.91,110.77 70,108.86 70,99.21 IC1.6 SV1.1 SV5.1 | IC2.6 31.77,99.84 v31.9,99.97
  Bottom 0.305: v31.9,99.97 36.47,95.4 SV5.1
40XX_CH_B_OUT  (via drill 0.35)
  Top 0.305: U$11.4 69.36,110 68.98,109.62 68.98,103.27 IC1.4 SV1.3 SV5.3 | IC2.4 31.77,102.38 v31.9,102.51
  Bottom 0.305: v31.9,102.51 33.93,100.48 SV5.3
40XX_CH_C_IN_A  (via drill 0.35)
  Top 0.305: SV6.6 SV2.6 IC1.8 70.51,96.16 70.51,108.61 73.17,111.28 U$11.7 | IC4.1 107.72,94.77 v107.59,94.89
  Bottom 0.305: v107.59,94.89 105.56,92.86 SV6.6
40XX_CH_C_IN_B  (via drill 0.35)
  Top 0.305: SV6.5 SV2.5 IC1.9 71.02,98.19 71.02,108.35 74.44,111.78 U$11.8 | IC4.2 107.72,96.03 v107.59,96.16
  Bottom 0.305: v107.59,96.16 106.83,95.4 SV6.5
40XX_CH_C_OUT  (via drill 0.35)
  Top 0.305: SV6.4 SV2.4 IC1.10 71.52,100.23 71.52,108.1 74.32,110.89 74.83,110.89 75.33,111.4 75.33,113.94 73.56,115.72 73.05,115.72 70.64,118.13 U$11.12 | IC4.3 107.72,97.31 v107.59,97.43
  Bottom 0.305: v107.59,97.43 107.08,97.94 SV6.4
40XX_CH_D_IN_A  (via drill 0.35)
  Top 0.305: IC1.12 SV2.2 SV6.2 81.94,104.8 81.94,106.07 76.35,111.66 76.35,114.45 73.17,117.62 U$11.10 | IC4.5 107.72,99.84 v107.59,99.97
  Bottom 0.305: v107.59,99.97 104.54,103.02 SV6.2
40XX_CH_D_IN_B  (via drill 0.35)
  Top 0.305: IC1.13 SV2.1 | SV2.1 SV6.1 | IC4.6 107.72,101.11 v107.59,101.24 | SV2.1 75.84,106.83 75.84,114.2 71.91,118.13 U$11.11
  Bottom 0.305: v107.59,101.24 103.27,105.56 SV6.1
40XX_CH_D_OUT  (via drill 0.35)
  Top 0.305: IC1.11 SV2.3 SV6.3 82.45,102.77 82.45,106.58 76.86,112.16 76.86,114.7 74.44,117.12 U$11.9 | IC4.4 107.72,98.58 v107.59,98.7
  Bottom 0.305: v107.59,98.7 105.81,100.48 SV6.3
40XX_CH_E_IN_A  (via drill 0.35)
  Top 0.305: SV7.6 SV3.6 IC3.1 66.19,80.41 65.56,81.05 U$3.1 | IC5.1 31.77,76.98 v31.9,77.11
  Bottom 0.305: v31.9,77.11 33.68,78.89 SV7.6
40XX_CH_E_IN_B  (via drill 0.35)
  Top 0.305: SV7.5 SV3.5 IC3.2 67.97,78.13 67.97,79.4 66.83,80.54 U$3.2 | IC5.2 31.77,75.72 v31.9,75.84
  Bottom 0.305: v31.9,75.84 32.41,76.35 SV7.5
40XX_CH_E_OUT  (via drill 0.35)
  Top 0.305: SV7.4 SV3.4 IC3.3 68.48,76.1 68.48,80.16 68.09,80.54 U$3.3 | IC5.3 31.77,74.44 v31.9,74.57
  Bottom 0.305: v31.9,74.57 32.66,73.81 SV7.4
40XX_CH_F_IN_A  (via drill 0.35)
  Top 0.305: SV7.2 SV3.2 IC3.5 69.49,72.03 69.49,79.91 70.64,81.05 U$3.5 | IC5.5 31.77,71.91 v31.9,72.03
  Bottom 0.305: v31.9,72.03 35.2,68.73 SV7.2
40XX_CH_F_IN_B  (via drill 0.35)
  Top 0.305: SV7.1 SV3.1 IC3.6 70,70 70,79.65 71.91,81.56 U$3.6 | IC5.6 31.77,70.64 v31.9,70.76
  Bottom 0.305: v31.9,70.76 36.47,66.19 SV7.1
40XX_CH_F_OUT  (via drill 0.35)
  Top 0.305: SV7.3 SV3.3 IC3.4 68.98,74.06 68.98,80.16 69.36,80.54 U$3.4 | IC5.4 31.77,73.17 v31.9,73.3
  Bottom 0.305: v31.9,73.3 33.93,71.27 SV7.3
40XX_CH_G_IN_A  (via drill 0.35)
  Top 0.305: SV8.6 SV4.6 IC3.8 70.51,66.95 70.51,79.4 73.17,82.06 U$3.7 | IC6.1 108.23,65.56 v108.1,65.68
  Bottom 0.305: v108.1,65.68 106.07,63.65 SV8.6
40XX_CH_G_IN_B  (via drill 0.35)
  Top 0.305: SV8.5 SV4.5 IC3.9 73.81,66.44 71.02,69.24 71.02,79.14 74.44,82.57 U$3.8 | IC6.2 108.23,66.83 v108.1,66.95
  Bottom 0.305: v108.1,66.95 107.34,66.19 SV8.5
40XX_CH_G_OUT  (via drill 0.35)
  Top 0.305: SV8.4 SV4.4 IC3.10 71.52,71.02 71.52,78.89 74.57,81.94 74.83,81.94 75.08,82.19 75.08,85.24 74.57,85.75 73.05,85.75 70.64,88.16 U$3.12 | IC6.3 108.23,68.09 v108.1,68.22
  Bottom 0.305: v108.1,68.22 107.59,68.73 SV8.4
40XX_CH_H_IN_A  (via drill 0.35)
  Top 0.305: IC3.12 SV4.2 SV8.2 80.67,73.81 81.94,75.08 81.94,77.11 76.1,82.95 76.1,85.75 75.08,86.76 74.57,86.76 73.17,88.16 U$3.10 | IC6.5 108.23,70.64 v108.1,70.76
  Bottom 0.305: v108.1,70.76 105.05,73.81 SV8.2
40XX_CH_H_IN_B  (via drill 0.35)
  Top 0.305: IC3.13 SV4.1 | SV4.1 SV8.1 | SV4.1 75.59,77.87 75.59,85.49 74.83,86.26 73.56,86.26 71.91,87.91 U$3.11 | IC6.6 108.23,71.91 v108.1,72.03
  Bottom 0.305: v108.1,72.03 103.78,76.35 SV8.1
40XX_CH_H_OUT  (via drill 0.35)
  Top 0.305: IC3.11 SV4.3 SV8.3 82.45,73.56 82.45,77.37 76.6,83.21 76.6,86 74.44,88.16 U$3.9 | IC6.4 108.23,69.36 v108.1,69.49
  Bottom 0.305: v108.1,69.49 106.32,71.27 SV8.3
GND  (via drill 0.35)
  Top 0.305: C1.1 C2.1 80,34 v90.5,23.5 | U$4.NC_1 70,38.62 | 70,38.62 U$4.NC_2 | U$4.SUBSTRATE_9 U$4.SUBSTRATE_8 U$4.SUBSTRATE_4 | U$4.SUBSTRATE_9 U$4.SUBSTRATE_5 | U$4.SUBSTRATE_5 U$4.SUBSTRATE_4 | U$4.SUBSTRATE_9 70,37.2 | 70,37.2 U$4.SUBSTRATE_10 | U$4.SUBSTRATE_10 U$4.SUBSTRATE_6 | U$4.SUBSTRATE_6 70.09,36.51 v70,36.51 69.91,36.51 U$4.SUBSTRATE_5 | U$4.SUBSTRATE_5 69.4,35.71 | 69.4,35.71 U$4.SUBSTRATE_1 | U$4.SUBSTRATE_1 U$4.SUBSTRATE_0 U$4.SUBSTRATE_4 | U$4.SUBSTRATE_1 U$4.SUBSTRATE_2 | U$4.SUBSTRATE_2 U$4.SUBSTRATE_6 | U$4.SUBSTRATE_6 U$4.SUBSTRATE_7 | U$4.SUBSTRATE_7 U$4.SUBSTRATE_11 U$4.SUBSTRATE_10 | U$4.SUBSTRATE_2 U$4.SUBSTRATE_3 | U$4.SUBSTRATE_3 U$4.SUBSTRATE_7 | U$4.GND_0 70.64,34.77 U$4.SUBSTRATE_2 | 70,37.2 70,38.62 | Q2.3 Q2.2 | Q2.2 Q2.1 | Q2.2 31.77,49.05 30.63,47.9 30.63,40.79 31.4,40.02 R4.1 | Q1.3 Q1.2 | Q1.2 Q1.1 | Q1.2 100.1,49.05 99.21,48.16 99.21,40.79 99.97,40.02 R3.1 | v27,34 27,37 25,39 23,39 21.5,37.5 R11.1 | IC5.8 31.77,68.09 v31.9,68.22 | IC2.8 31.77,97.31 v31.9,97.43 | IC4.8 107.72,103.66 v107.59,103.78 | IC6.8 108.23,74.44 v108.1,74.57 | R7.1 120.53,102.5 v121.05,103.02 | 69.4,35.71 69.36,35.71 69.36,36 | R9.1 101.36,19.96 v96.42,19.96 | R8.1 120.04,38.64 v120.04,42.06 | U$4.NC_0 71.91,34.7 U$4.SUBSTRATE_3 | IC7.8 65.56,47.01 v65.68,46.89 | R6.1 104.16,118.9 v104.29,118.77 | R12.2 4,83.76 v4.21,83.97
  Bottom 0.305: v96.42,19.96 92.88,23.5 v90.5,23.5 | v120.04,42.06 123.09,42.06 124.1,41.04 126.64,41.04 132.5,46.9 LDR_PRO_B_IN1.1 | v65.68,46.89 70,42.57 v70,36.51 | v104.29,118.77 104.29,114.2 98.7,108.61 98.7,106.83 99.21,106.32 105.05,106.32 v107.59,103.78 | v4.21,83.97 4.21,89.22 4.28,89.48 LDR_PRO_D_IN1.1
  pour Top: 0,140 140,140 140,0 0,0
  pour Bottom: -10,150 150,150 150,-10 -10,-10
LDR_CH_A_OUT
  Top 0.305: JP3.3 26.2,112 18.11,112 U$8.2 18.05,108.06 LDR_A.2
LDR_CH_B_OUT
  Top 0.305: JP3.4 28.05,113.74 U$12.2 31.95,121.94 LDR_B.2
LDR_CH_C_OUT
  Top 0.305: JP4.3 111.94,113.74 U$13.2 108.06,121.94 LDR_C.2
LDR_CH_D_OUT
  Top 0.305: JP4.4 113.74,111.94 U$14.2 121.94,108.06 LDR_D.2
LDR_CH_E_OUT
  Top 0.305: JP5.3 113.74,28.05 U$15.2 121.94,31.95 LDR_E.2
LDR_CH_F_OUT
  Top 0.305: JP5.4 111.94,26.26 U$16.2 108.06,18.05 LDR_F.2
LDR_CH_G_OUT
  Top 0.305: JP6.3 28.05,26.26 U$17.2 31.95,18.05 LDR_G.2
LDR_CH_H_OUT
  Top 0.305: JP6.4 26.26,28.05 U$18.2 18.05,31.95 LDR_H.2
LDR_PRO_A_OUT  (via drill 0.35)
  Top 0.305: LDR_PRO_A_IN2.1 78.8,132.5 | 78.8,132.5 LDR_PRO_A_IN1.2 | 78.8,132.5 v78.8,115.83
  Bottom 0.305: v78.8,115.83 71.6,108.63 71.6,58.46 66.23,53.08 JP7.2
LDR_PRO_B_OUT  (via drill 0.35)
  Top 0.305: LDR_PRO_B_IN2.1 LDR_PRO_B_IN1.2 | v70.91,55.26 83.6,55.26 87.83,51.03 107.83,51.03 108.86,50 108.86,47.03 117.78,38.11 117.78,36.4 117.89,36.28 120.63,36.28 v127.04,42.68
  Bottom 0.305: v70.91,55.26 68.74,53.08 JP7.3 | v127.04,42.68 127.04,46.8 132.41,52.17 132.41,52.63 LDR_PRO_B_IN1.2
LDR_PRO_C_OUT
  Top 0.305: LDR_PRO_C_IN1.2 55.24,7.5 59.12,11.38 | LDR_PRO_C_IN2.1 84.76,7.5 73.59,18.67 66.41,18.67 59.12,11.38 | 59.12,11.38 48.17,22.34 48.17,42.8 55.6,50.23 67.48,50.23 70.23,52.97 71.26,52.97 JP7.4
LDR_PRO_D_OUT  (via drill 0.35)
  Top 0.305: LDR_PRO_D_IN1.2 LDR_PRO_D_IN2.1 | v17.88,41.77 23.37,41.77 24.97,43.37 24.97,43.83 35.71,54.57 71.94,54.57 73.43,53.08 73.77,53.08 JP7.5
  Bottom 0.305: v17.88,41.77 17.54,42.11 13.99,42.11 9.08,47.03 9.08,50.68 7.59,52.17 7.59,52.63 LDR_PRO_D_IN2.1
LED_CH_A_IN
  Top 0.305: IC2.7 28.73,98.58 27.31,99.99 JP3.2
LED_CH_A_OUT
  Top 0.305: IC2.10 35.71,98.58 33.77,96.63 28.97,96.63 25.65,99.95 21.42,99.95 R99.2
LED_CH_B_IN
  Top 0.305: IC4.7 109.43,102.35 107.72,102.35 104.63,99.26 104.63,94.23 104.52,94.12 99.83,94.12 96.29,97.66 96.29,104.06 93.2,107.15 85.77,107.15 75.14,117.78 75.14,119.95 74.92,120.18 63.83,120.18 56.4,112.75 32.74,112.75 JP3.5
LED_CH_B_OUT
  Top 0.305: R100.2 40.05,118.69 61.66,118.69 63.6,120.63 75.14,120.63 78.11,117.66 78.11,115.49 85.49,108.11 100.7,108.11 104.63,104.18 104.63,103.15 103.95,102.46 103.38,102.46 IC4.10
LED_CH_C_IN
  Top 0.305: IC5.7 30.45,69.43 34.68,69.43 35.25,70 40.17,70 43.71,73.54 43.71,77.43 57.2,90.92 75.72,90.92 75.83,90.8 107.95,90.8 111.26,94.12 111.26,106.46 107.38,110.35 107.38,112.63 JP4.2
LED_CH_C_OUT
  Top 0.305: R101.2 100.06,118.58 100.06,116.41 101.55,114.92 104.4,114.92 105.09,115.61 106,115.61 106.69,114.92 106.69,113.66 106.23,113.2 106.23,108.75 110.81,104.18 110.81,94.35 107.72,91.26 76.06,91.26 75.94,91.37 49.08,91.37 32.62,74.92 32.62,70.46 32.17,70 29.2,70 28.97,69.77 28.97,67.6 29.2,67.37 33.99,67.37 35.94,69.31 36.4,69.31 IC5.10
LED_CH_D_IN
  Top 0.305: IC6.7 109.66,73.2 110.23,73.2 114.92,77.89 114.92,104.4 115.61,105.09 115.61,106 114.35,107.26 112.75,107.26 JP4.5
LED_CH_D_OUT  (via drill 0.35)
  Top 0.305: v115.61,98 117.55,99.95 118.58,99.95 R102.2 | v114.23,96.63 114.23,83.37 104.06,73.2 103.6,73.2 IC6.10
  Bottom 0.305: v114.23,96.63 v115.61,98
LED_CH_E_IN
  Top 0.305: IC7.1 74.46,48.74 91.26,31.94 91.26,20.97 89.43,19.14 89.43,17.65 89.55,17.54 91.03,17.54 95.95,22.45 95.95,23.37 105.2,32.62 112.63,32.62 JP5.2
LED_CH_F_IN  (via drill 0.35)
  Top 0.305: v102.8,31.94 84.52,50.23 74,50.23 73.2,49.43 73.2,48.86 IC7.2
  Bottom 0.305: v102.8,31.94 107.38,27.37 JP5.5
LED_CH_G_IN  (via drill 0.35)
  Top 0.305: v45.31,40.62 55.37,50.68 62.91,50.68 64.74,52.51 64.74,53.08 65.77,54.11 71.71,54.11 72.4,53.43 72.4,52.51 71.94,52.05 71.94,48.86 IC7.3
  Bottom 0.305: v45.31,40.62 32.62,27.94 32.62,27.37 JP6.2
LED_CH_H_IN  (via drill 0.35)
  Top 0.305: v48.86,35.14 58.23,44.51 66.91,44.51 70.57,48.17 70.57,48.74 IC7.4 | v46.91,33.2 27.82,33.2 27.37,32.74 JP6.5
  Bottom 0.305: v46.91,33.2 v48.86,35.14
MOTOR_A-
  Top 0.305: Q1.8 Q1.7 107.03,48.16 | 107.03,48.16 Q1.6 Q1.5 | 107.03,48.16 110.39,44.8 110.39,38.51 U$1.P$1
MOTOR_A_IN
  Top 0.305: R1.1 38.34,40.05 38.34,40.74 39.48,41.88 39.48,43.94 37.31,46.11 37.31,50.68 39.6,52.97 63.6,52.97 JP7.1
MOTOR_B-
  Top 0.305: Q2.8 Q2.7 Q2.6 Q2.5 47.65,37.31 47.65,20.47 U$2.P$1
MOTOR_B_IN
  Top 0.305: R2.1 106.81,39.94 103.83,39.94 102.8,38.91 96.52,38.91 82.46,52.97 76.4,52.97 JP7.6
N$5
  Top 0.305: IC2.16 U$5.1
N$6
  Top 0.305: R2.2 R3.2 101.75,46.3 Q1.4
N$7
  Top 0.305: R1.2 R4.2 32.97,43.03 Q2.4
N$8
  Top 0.305: U$5.2 IC2.15
N$9
  Top 0.305: IC2.14 U$5.3
N$10
  Top 0.305: U$5.4 IC2.13
N$11
  Top 0.305: IC2.12 U$5.5
N$12
  Top 0.305: U$5.6 IC2.11
N$13
  Top 0.305: IC6.16 U$10.1
N$14
  Top 0.305: U$6.1 IC4.16
N$15
  Top 0.305: IC4.15 U$6.2
N$16
  Top 0.305: U$6.3 IC4.14
N$17
  Top 0.305: U$6.4 IC4.13
N$18
  Top 0.305: IC4.12 U$6.5
N$19
  Top 0.305: U$6.6 IC4.11
N$20
  Top 0.305: U$5.16 46.76,106.19 48.66,108.1 D6.C
N$21
  Top 0.305: IC6.14 U$10.3
N$22
  Top 0.305: U$5.15 46.76,104.92 47.39,105.56 D5.C
N$23
  Top 0.305: IC5.16 U$9.1
N$24
  Top 0.305: U$5.14 46.76,103.66 47.39,103.02 D4.C
N$25
  Top 0.305: U$9.2 IC5.15
N$26
  Top 0.305: U$5.13 46.76,102.38 48.66,100.48 D3.C
N$27
  Top 0.305: IC5.14 U$9.3
N$28
  Top 0.305: U$5.12 46.76,101.11 49.93,97.94 D2.C
N$29
  Top 0.305: U$9.4 IC5.13
N$30
  Top 0.305: U$5.11 46.76,99.84 51.2,95.4 D1.C
N$31
  Top 0.305: IC5.12 U$9.5
N$32
  Top 0.305: U$9.6 IC5.11
N$33
  Top 0.305: U$10.2 IC6.15
N$34
  Top 0.305: U$10.4 IC6.13
N$35
  Top 0.305: U$10.5 IC6.12
N$36
  Top 0.305: D12.C 87.78,92.86 89.69,94.77 U$6.16
N$37
  Top 0.305: D11.C 87.78,95.4 88.41,96.03 U$6.15
N$38
  Top 0.305: U$10.6 IC6.11
N$39
  Top 0.305: D10.C 87.78,97.94 88.41,97.31 U$6.14
N$40
  Top 0.305: D9.C 87.78,100.48 89.69,98.58 U$6.13
N$41
  Top 0.305: D8.C 87.78,103.02 90.95,99.84 U$6.12
N$42
  Top 0.305: U$6.11 92.22,101.11 87.78,105.56 D7.C
N$44
  Top 0.305: U$8.1 23.9,104.47 R39.2
N$45
  Top 0.305: U$12.1 32.27,116.1 R5.2
N$46  (via drill 0.35)
  Top 0.305: v88.17,51.71 107.83,51.71 109.32,50.23 109.32,49.08 118.35,40.05 118.58,40.05 R111.2 | v79.26,42.8 74.57,42.8 74.46,42.68 IC7.16
  Bottom 0.305: v79.26,42.8 v88.17,51.71
N$47  (via drill 0.35)
  Top 0.305: v96.63,23.02 98.23,21.42 99.95,21.42 R112.2 | v78.34,41.31 74,41.31 73.2,42.11 73.2,42.57 IC7.15
  Bottom 0.305: v78.34,41.31 v96.63,23.02
N$48  (via drill 0.35)
  Top 0.305: v46.91,31.14 40.05,24.28 40.05,21.42 R113.2 | v53.43,37.65 55.6,37.65 62,44.05 71.03,44.05 71.83,43.25 71.83,42.68 IC7.14
  Bottom 0.305: v53.43,37.65 v46.91,31.14
N$49  (via drill 0.35)
  Top 0.305: v46.91,36.97 33.77,36.97 30.8,39.94 21.42,39.94 R114.2 | v51.71,36.97 55.6,36.97 59.94,41.31 69.89,41.31 70.57,42 70.57,42.57 IC7.13
  Bottom 0.305: v51.71,36.97 v46.91,36.97
N$50
  Top 0.305: U$13.1 104.47,116.1 R6.2
N$51
  Top 0.305: U$14.1 116.1,107.73 R7.2
N$52
  Top 0.305: U$15.1 116.1,35.53 R8.2
N$53
  Top 0.305: U$16.1 107.73,23.9 R9.2
N$54
  Top 0.305: U$17.1 35.53,23.9 R10.2
N$55
  Top 0.305: U$18.1 23.9,32.27 R11.2
N$61
  Top 0.305: D13.A 68.73,24.92 JP8.1
N$62
  Top 0.305: U$4.EN 73.05,37.48 73.05,32.05 U$7.NC
N$63
  Top 0.305: R12.1 LED_IR_A.K
N$64
  Top 0.305: R13.1 LED_IR_B.K
N$86
  Top 0.305: U$9.16 46.5,76.98 48.41,78.89 D20.C
N$87
  Top 0.305: U$9.15 46.5,75.72 47.14,76.35 D19.C
N$88
  Top 0.305: U$9.14 46.5,74.44 47.14,73.81 D18.C
N$89
  Top 0.305: U$9.13 46.5,73.17 48.41,71.27 D17.C
N$90
  Top 0.305: U$9.12 46.5,71.91 49.68,68.73 D16.C
N$91
  Top 0.305: U$9.11 46.5,70.64 50.95,66.19 D15.C
N$92
  Top 0.305: U$10.16 93.5,65.56 91.59,63.65 D26.C
N$93
  Top 0.305: U$10.15 93.5,66.83 92.86,66.19 D25.C
N$94
  Top 0.305: U$10.14 93.5,68.09 92.86,68.73 D24.C
N$95
  Top 0.305: U$10.13 93.5,69.36 91.59,71.27 D23.C
N$96
  Top 0.305: U$10.12 93.5,70.64 90.32,73.81 D22.C
N$97
  Top 0.305: U$10.11 93.5,71.91 89.05,76.35 D21.C
N$111
  Top 0.305: R99.1 15.74,97.14 14.2,97.14 13.66,96.6 LED_A.K
N$112
  Top 0.305: R100.1 43.4,124.8 LED_B.K
N$113
  Top 0.305: R101.1 96.6,124.8 LED_C.K
N$114
  Top 0.305: R102.1 124.26,97.14 125.8,97.14 126.34,96.6 LED_D.K
N$123
  Top 0.305: R111.1 124.08,42.68 125.8,42.68 126.52,43.4 LED_E.K
N$124
  Top 0.305: R112.1 96.6,15.2 LED_F.K
N$125
  Top 0.305: R113.1 43.4,15.2 LED_G.K
N$126
  Top 0.305: R114.1 15.92,42.68 14.2,42.68 13.48,43.4 LED_H.K
VBAT
  Top 0.305: U$7.COM 68.85,32.15 67.21,32.15 66.7,32.66 66.7,38.25 | 66.7,38.25 67.07,38.62 U$4.V_IN 68.09,39.9 68.73,40.54 79.86,40.54 C1.2 | D13.C 66.6,38.35 66.7,38.25
VDD  (via drill 0.35)
  Top 0.305: D20.A D19.A D18.A D17.A D16.A D15.A 56.26,65.04 56.4,64.9 | D1.A D2.A D3.A D4.A D5.A D6.A 56.17,108.18 55.03,108.18 52.74,110.46 32.05,110.46 | U$4.V_OUT U$4.V_OUT_MON 69.36,32.79 70,32.15 70.51,32.15 71.02,31.65 71.02,30.12 72.03,29.11 76.35,29.11 | 80,31.39 80,29.96 79.14,29.11 76.35,29.11 | 80,31.39 C2.2 | 80,31.39 81.31,31.39 U$1.P$2 90.23,22.34 88.97,21.08 88.97,17.42 92.75,13.65 92.75,7.71 LDR_PRO_C_IN2.2 92.75,7.59 96.75,7.59 98.35,9.19 98.35,10.79 LED_F.A 98.46,11.02 100.52,13.08 103.03,13.08 LDR_F.1 103.15,13.19 103.15,19.59 103.72,20.16 103.72,22.11 103.03,22.79 101.43,22.79 101.2,23.02 101.2,24.74 101.89,25.42 105.43,25.42 JP5.6 105.55,25.54 105.55,27.14 110.46,32.05 111.72,32.05 112.18,31.59 113.2,31.59 114.46,32.85 | U$2.P$2 56.45,22.41 57.55,23.52 63.65,23.52 66.44,20.72 73.05,20.72 76.35,24.03 76.35,29.11 | v78.23,82.57 78.23,82.23 82.98,77.48 | 82.98,77.48 83.6,76.86 83.6,76.4 D21.A 83.72,76.29 83.72,73.89 D22.A 83.72,73.66 83.72,71.37 D23.A 83.72,71.26 83.72,68.86 D24.A 83.72,68.63 83.72,66.34 D25.A 83.72,66.11 83.72,63.71 D26.A 83.6,63.6 82.43,62.43 58.87,62.43 56.4,64.9 | v81.09,108.98 81.09,108.63 83.72,106 83.72,105.66 D7.A 83.72,105.55 83.72,103.15 D8.A 83.72,102.92 83.72,100.63 D9.A 83.72,100.4 83.72,98 D10.A 83.72,97.89 83.72,95.49 D11.A 83.72,95.38 83.72,92.86 D12.A 82.23,92.86 81.2,91.83 78.69,91.83 | LDR_PRO_A_IN2.2 47.25,132.41 43.25,132.41 41.65,130.81 41.65,129.21 LED_B.A 41.54,129.09 39.37,126.92 36.97,126.92 LDR_B.1 36.85,126.81 36.85,124.86 29.65,117.66 29.65,117.32 32.68,114.29
  Top 0.305: 32.68,114.29 31.59,113.2 31.59,111.72 32.05,111.26 32.05,110.46 | 32.68,114.29 32.85,114.46 34.45,114.46 JP3.6 | 32.05,110.46 29.54,107.95 28.28,107.95 27.82,108.41 26.8,108.41 25.54,107.15 25.54,105.66 JP3.1 25.42,105.55 24.28,105.55 21.08,108.75 20.28,108.75 14.68,103.15 13.19,103.15 LDR_A.1 13.08,103.03 13.08,100.63 10.91,98.46 LED_A.A 10.79,98.35 9.19,98.35 5.99,95.15 5.99,70.8 4.05,68.86 LED_IR_A.A 4.05,68.63 4.05,50.8 7.48,47.37 LDR_PRO_D_IN2.2 7.59,47.25 7.59,43.25 9.19,41.65 10.79,41.65 LED_H.A 10.91,41.54 13.08,39.37 13.08,36.97 LDR_H.1 13.19,36.85 14.68,36.85 21.88,29.65 22.68,29.65 25.71,32.68 | 78.69,91.83 59.94,91.83 56.4,95.38 D1.A | v78.69,91.95 78.69,91.83 | 101.32,126.92 100.63,126.92 98.46,129.09 LED_C.A | 101.32,126.92 103.03,126.92 LDR_C.1 | 101.32,120.52 101.09,120.29 99.49,120.29 98.69,119.49 98.69,117.09 101.32,114.46 105.43,114.46 JP4.1 | 101.32,126.92 101.32,120.52 | 111.6,107.83 111.6,106.81 112.86,105.55 114.46,105.55 JP4.6 | 111.6,107.83 114.12,110.35 118.12,110.35 125.32,103.15 126.81,103.15 LDR_D.1 126.92,103.03 126.92,100.52 128.98,98.46 LED_D.A 129.21,98.35 130.81,98.35 132.41,96.75 132.41,92.75 LDR_PRO_B_IN2.2 132.52,92.63 133.55,91.6 133.55,72.06 135.95,69.66 135.95,68.74 LED_IR_B.A 135.95,68.63 135.95,50.57 133.55,48.17 133.55,44.4 130.81,41.65 129.21,41.65 LED_E.A 129.09,41.54 126.92,39.37 126.92,36.97 LDR_E.1 126.81,36.85 124.86,36.85 119.26,31.25 118.58,31.25 116.98,32.85 114.46,32.85 | 101.32,120.52 107.49,120.52 108.75,119.26 108.75,118.58 107.38,117.21 107.38,114.23 108.41,113.2 108.41,111.72 107.95,111.26 107.95,110.46 110.58,107.83 111.6,107.83
  Top 0.305: 114.46,32.85 114.46,34.45 JP5.1 | LED_G.A 41.54,10.91 39.37,13.08 36.97,13.08 LDR_G.1 36.85,13.19 36.85,15.14 31.25,20.74 31.25,21.42 34.45,24.62 34.45,25.42 JP6.1 34.45,25.54 34.45,27.14 29.54,32.05 28.28,32.05 27.82,31.59 26.8,31.59 25.71,32.68 | 25.71,32.68 25.54,32.85 25.54,34.45 JP6.6 | IC5.9 36.5,68 39.5,65 56.5,65 56.4,64.9 | v64.5,42.5 65.5,42.5 IC7.9 | IC6.9 103.5,74.5 100.5,77.5 83,77.5 82.98,77.48 | IC2.9 36.5,97 37.5,97 40.5,94 55,94 56,95 D1.A | IC4.9 103.3,103.97 v100,107.26
  Bottom 0.305: IC3.14 73.89,78.91 74.57,78.91 v78.23,82.57 78.23,91.26 78.8,91.83 v78.69,91.95 | v81.09,108.98 75.72,108.98 74.92,108.18 73.89,108.18 IC1.14 | LED_G.A 41.65,10.91 42.8,12.05 42.8,13.76 49.77,20.74 49.77,22.34 U$2.P$2 49.5,22.5 49.5,27.5 v64.5,42.5 | v100,107.26 100,107.77 105,112.77 105,114.5 JP4.1

### Text on the board
_tsilk: LDR front | Battle Bits PCB V2.0 | Designed by / Jelle Reith / February 2021 | Trimpots | Trimpots | 4000 Series chip | 1 | 14 | VDD | 2 | 13 | 3 | 12 | 4 | 11 | 5 | 10 | 6 | 9 | GND | 7 | 8 | 4000 Series chip | 1 | 14 | VDD | 2 | 13 | 3 | 12 | 4 | 11 | IR Tracking led | LDR left | LDR right | IR Tracking led | 5 | 10 | 6 | 9 | GND | 7 | 8 | Motor left | LDR front | LDR right | LDR rear | LDR left | Motor right | Motor MOSFET | Motor MOSFET | 0 | 1 | +V_BAT | - V_BAT | Trimpots | Trimpots
_bsilk: Battle Bits PCB V2.0 | Designed by / Jelle Reith / / February 2021 | Jelle Reith / Jellereith.nl / / Ibo Ibelings / Iboibelings.nl